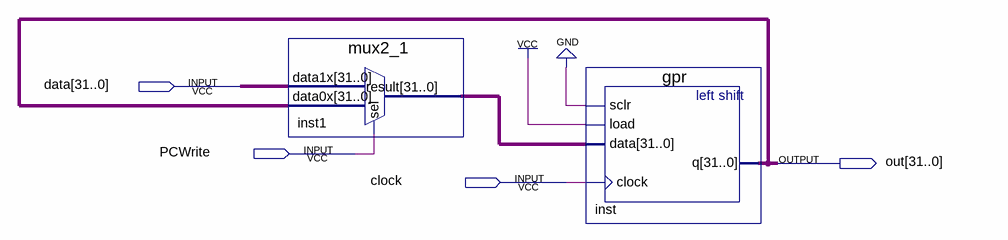
[diagram p0: schematic sheet]
// Quartus schematic PC.bdf as structural Verilog: 2 symbols, 4 pins
module PC (
  input  [31:0] data,
  input  PCWrite,
  input  clock,
  output [31:0] out
);

  wire [31:0] inst1_result;

  mux2_1 inst1 (.data1x(data), .data0x(out), .sel(PCWrite), .result(inst1_result));
  gpr inst (.sclr(1'b0), .load(1'b1), .data(inst1_result), .clock(clock), .q(out));
endmodule
